# EAGLE design Prototype2 (EAGLE 6.1)
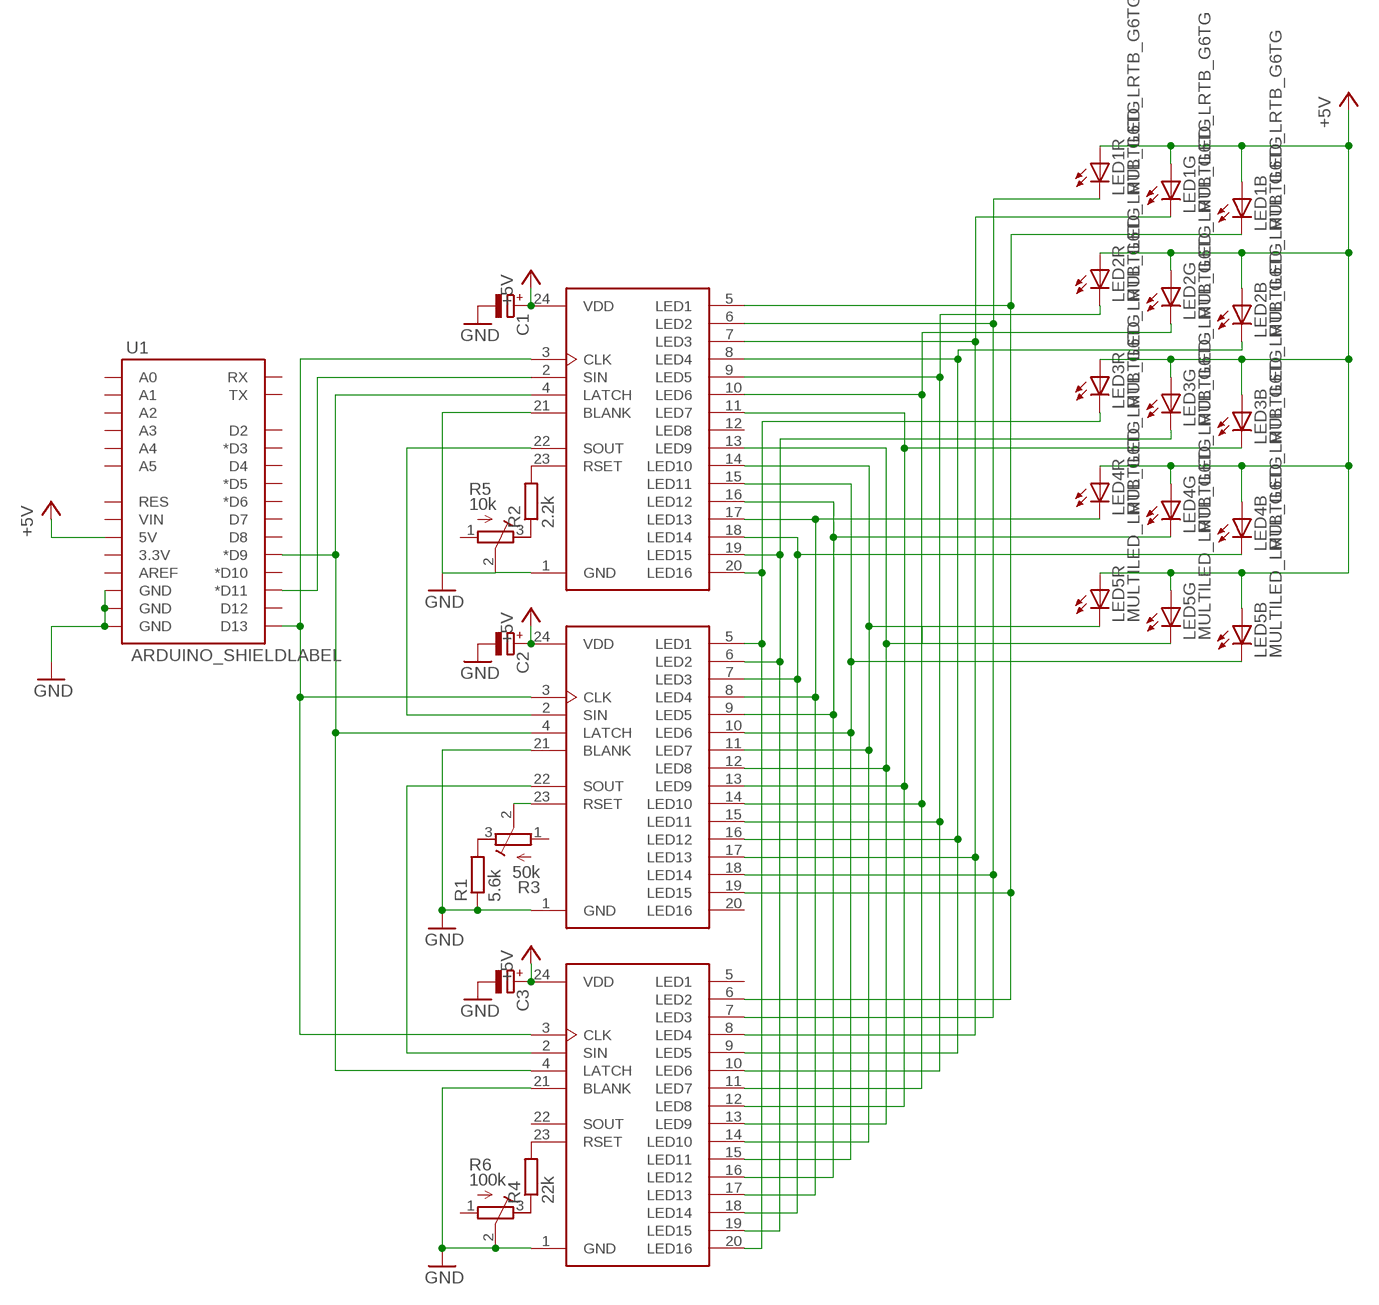
[diagram p0: schematic, sheet 1]

## Parts
C1  CPOL-EUA/3216-18W  [A/3216-18W]
C2  CPOL-EUA/3216-18W  [A/3216-18W]
C3  CPOL-EUA/3216-18W  [A/3216-18W]
LED1  MULTILED_LRTB_G6TG  [P-LCC-6_TOPLED]
LED2  MULTILED_LRTB_G6TG  [P-LCC-6_TOPLED]
LED3  MULTILED_LRTB_G6TG  [P-LCC-6_TOPLED]
LED4  MULTILED_LRTB_G6TG  [P-LCC-6_TOPLED]
LED5  MULTILED_LRTB_G6TG  [P-LCC-6_TOPLED]
R1  5.6k  R-EU_0204/7  [0204/7]
R2  2.2k  R-EU_0204/7  [0204/7]
R3  50k  R-TRIMM3165W  [RTRIM3165W]
R4  22k  R-EU_0204/7  [0204/7]
R5  10k  R-TRIMM3165W  [RTRIM3165W]
R6  100k  R-TRIMM3165W  [RTRIM3165W]
U1  ARDUINO_SHIELDLABEL  [DUEMILANOVE_SHIELD]
U$1  CAT4016  [SOIC24W]
U$2  CAT4016  [SOIC24W]
U$3  CAT4016  [SOIC24W]

## Nets
+5V: C1.+ C2.+ C3.+ LED1.A1(R:A) LED1.A2(G:A) LED1.A3(B:A) LED2.A1(R:A) LED2.A2(G:A) LED2.A3(B:A) LED3.A1(R:A) LED3.A2(G:A) LED3.A3(B:A) LED4.A1(R:A) LED4.A2(G:A) LED4.A3(B:A) LED5.A1(R:A) LED5.A2(G:A) LED5.A3(B:A) U1.5V U$1.24(VDD) U$2.24(VDD) U$3.24(VDD)
GND: C1.- C2.- C3.- R1.1 R5.2(S) R6.2(S) U1.GND@0(GND) U1.GND@1(GND) U1.GND@2(GND) U$1.1(GND) U$1.21(BLANK) U$2.1(GND) U$2.21(BLANK) U$3.1(GND) U$3.21(BLANK)
N$1: R2.2 U$3.23(RSET)
N$2: R2.1 R5.3(E)
N$3: R4.2 U$2.23(RSET)
N$4: U$1.2(SIN) U$3.22(SOUT)
N$5: U1.D11(*D11) U$3.2(SIN)
N$6: U1.D9(*D9) U$1.4(LATCH) U$2.4(LATCH) U$3.4(LATCH)
N$7: R4.1 R6.3(E)
N$8: R1.2 R3.3(E)
N$9: R3.2(S) U$1.23(RSET)
N$10: U$1.22(SOUT) U$2.2(SIN)
N$14: U1.D13 U$1.3(CLK) U$2.3(CLK) U$3.3(CLK)
N$15: LED5.C2(G:C) U$1.12(LED8) U$2.13(LED9) U$3.13(LED9)
N$18: LED5.C1(R:C) U$1.11(LED7) U$2.14(LED10) U$3.14(LED10)
N$19: LED5.C3(B:C) U$1.10(LED6) U$2.15(LED11) U$3.15(LED11)
N$20: LED4.C2(G:C) U$1.9(LED5) U$2.16(LED12) U$3.16(LED12)
N$21: LED4.C1(R:C) U$1.8(LED4) U$2.17(LED13) U$3.17(LED13)
N$22: LED4.C3(B:C) U$1.7(LED3) U$2.18(LED14) U$3.18(LED14)
N$23: LED3.C2(G:C) U$1.6(LED2) U$2.19(LED15) U$3.19(LED15)
N$25: LED3.C3(B:C) U$1.13(LED9) U$2.12(LED8) U$3.11(LED7)
N$31: LED2.C2(G:C) U$1.14(LED10) U$2.11(LED7) U$3.10(LED6)
N$32: LED2.C1(R:C) U$1.15(LED11) U$2.10(LED6) U$3.9(LED5)
N$33: LED2.C3(B:C) U$1.16(LED12) U$2.9(LED5) U$3.8(LED4)
N$34: LED1.C2(G:C) U$1.17(LED13) U$2.8(LED4) U$3.7(LED3)
N$39: LED1.C1(R:C) U$1.18(LED14) U$2.7(LED3) U$3.6(LED2)
N$43: LED1.C3(B:C) U$1.19(LED15) U$2.6(LED2) U$3.5(LED1)
N$59: LED3.C1(R:C) U$1.5(LED1) U$2.20(LED16) U$3.20(LED16)
Unconnected: R3.1(A) R5.1(A) R6.1(A) U1.3.3V U1.A0 U1.A1 U1.A2 U1.A3 U1.A4 U1.A5 U1.AREF U1.D2 U1.D3(*D3) U1.D4 U1.D5(*D5) U1.D6(*D6) U1.D7 U1.D8 U1.D10(*D10) U1.D12 U1.RES U1.RX U1.TX U1.VIN U$1.20(LED16) U$2.5(LED1) U$2.22(SOUT) U$3.12(LED8)

## Library data of the parts
C1-C3 = rcl:CPOL-EU: POLARIZED CAPACITOR, European symbol
LED1-LED5 = customized:MULTILED_LRTB_G6TG: 6-lead MULTILED® Enhanced optical Power LED (ThinFilm® / ThinGaN®) Source. OSRAM - LRTB_G6TG.pdf
R1 R2 R4 = rcl:R-EU_: RESISTOR, European symbol
R3 R5 R6 = rcl:R-TRIMM: Trimm resistor
U1 = SparkFun:ARDUINO_SHIELD
U$1-U$3 = CAT4016:CAT4016: 16-Channel Constant Current LED Driver

## Board
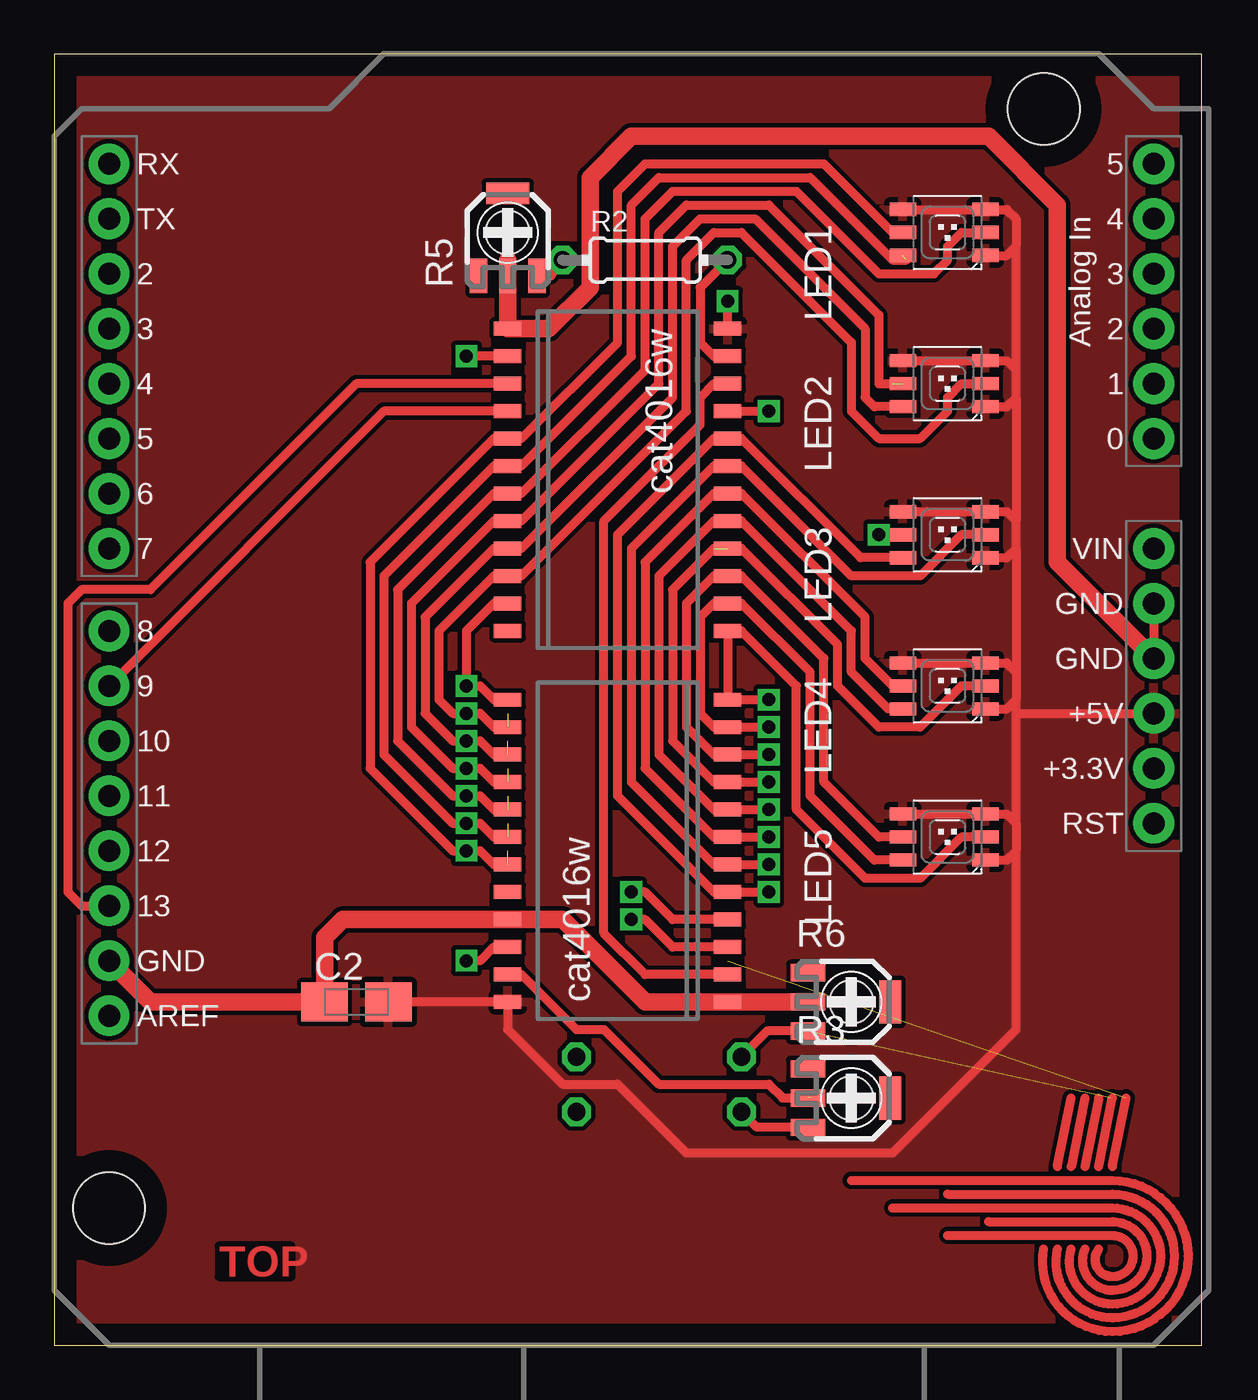
[diagram p1: board, top side]
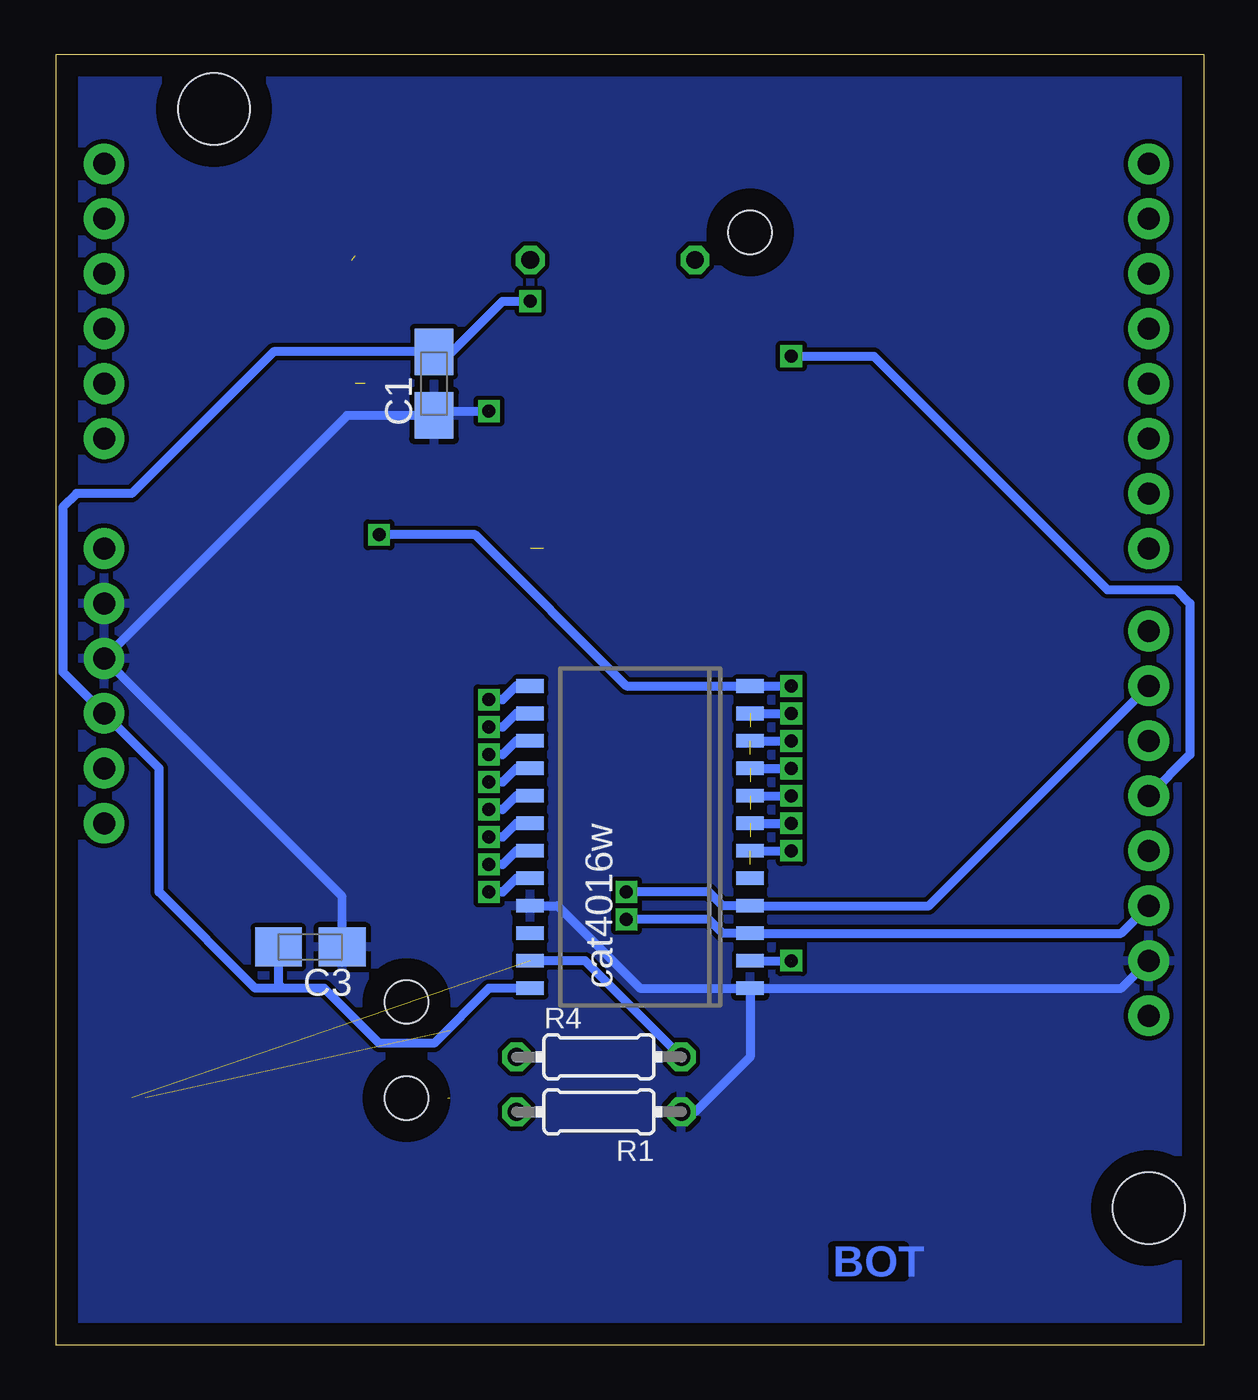
[diagram p2: board, bottom side, seen from below]

Size 53.01 x 59.68 mm. Coordinates in mm from the lower left corner, seen from the top.
Outline: 0,0 53.01,0 53.01,59.68 0,59.68 0,0
Copper layers (1*16): Top 0.035mm / dielectric 1.5mm / Bottom 0.035mm
Design rules: minimum track width 10mil, minimum drill 24mil, track to track 8mil, track to pad 8mil, pad to pad 8mil, via to via 8mil, smd to smd 8mil, copper to edge 40mil, drill to drill 8mil, minimum pad ring 10mil, minimum via ring 8mil, stop-mask expansion 4mil, vias tented up to drill 0mil, thermal gap 10mil

### Footprints (pad centres in the part's own frame; a part is rotated, then mirrored left to right if it is on the bottom)
A/3216-18W = smd 2.15 x 1.8: + 1.475,0; - -1.475,0
P-LCC-6_TOPLED = smd 0.61 x 1.219: A1 -1.062,-1.748; A2 1.062,-1.748; A3 1.062,2.065; C1 -1.062,2.065; C2 0,-1.748; C3 0,2.065
0204/7 = drill 0.813 octagon: 1 -3.81,0; 2 3.81,0
RTRIM3165W = smd 0.8 x 1.6: 1 -1.35,-2; 2 0,-2; 3 1.35,-2 | smd 2 x 1: 4 0,1.8 | hole 2: 0,0
DUEMILANOVE_SHIELD = drill 1.016 pad 1.88: 3.3V 50.8,26.67; 5V 50.8,29.21; A0 50.8,41.91; A1 50.8,44.45; A2 50.8,46.99; A3 50.8,49.53; A4 50.8,52.07; A5 50.8,54.61; AREF 2.54,15.24; D2 2.54,49.53; D3 2.54,46.99; D4 2.54,44.45; D5 2.54,41.91; D6 2.54,39.37; D7 2.54,36.83; D8 2.54,33.02; D9 2.54,30.48; D10 2.54,27.94; D11 2.54,25.4; D12 2.54,22.86; D13 2.54,20.32; GND@0 50.8,31.75; GND@1 50.8,34.29; GND@2 2.54,17.78; RES 50.8,24.13; RX 2.54,54.61; TX 2.54,52.07; VIN 50.8,36.83 | hole 3.302: 45.72,57.15; 2.54,6.35
SOIC24W = smd 0.635 x 1.27: 1 -6.985,-5.08; 2 -5.715,-5.08; 3 -4.445,-5.08; 4 -3.175,-5.08; 5 -1.905,-5.08; 6 -0.635,-5.08; 7 0.635,-5.08; 8 1.905,-5.08; 9 3.175,-5.08; 10 4.445,-5.08; 11 5.715,-5.08; 12 6.985,-5.08; 13 6.985,5.08; 14 5.715,5.08; 15 4.445,5.08; 16 3.175,5.08; 17 1.905,5.08; 18 0.635,5.08; 19 -0.635,5.08; 20 -1.905,5.08; 21 -3.175,5.08; 22 -4.445,5.08; 23 -5.715,5.08; 24 -6.985,5.08

### Placement (x,y rotation side)
C1  35.56,44.45 90 bottom
C2  13.97,15.88 0 top
C3  41.27,18.41 180 bottom
LED1  41.27,51.44 90 top
LED2  41.27,44.45 90 top
LED3  41.27,37.47 90 top
LED4  41.27,30.48 90 top
LED5  41.27,23.5 90 top
R1  27.94,10.79 180 bottom
R2  27.3,50.16 0 top
R3  36.83,11.43 270 top
R4  27.94,13.34 0 bottom
R5  20.95,51.44 0 top
R6  36.83,15.88 270 top
U1  0,0 0 top
U$1  26.04,22.86 90 top
U$2  26.04,23.5 90 bottom
U$3  26.04,40.01 270 top

### Tracks (layer width: path | path; a pad name or v marks a point on that pad's centre or on a via)
+5V
  Top 0.406: LED3.A3 LED3.A2 44.02,38.53 44.45,38.1 | LED3.A1 44.02,36.4 44.45,36.83 | 44.45,36.83 44.45,38.1 | LED4.A3 LED4.A2 44.02,31.54 44.45,31.11 | 44.45,31.11 44.45,29.84 | LED4.A1 44.02,29.42 44.45,29.84 | LED5.A3 LED5.A2 44.02,24.56 44.45,24.13 | LED5.A1 44.02,22.43 44.45,22.86 | 44.45,24.13 44.45,22.86 | C2.+ U$1.24 20.95,14.61 23.5,12.06 26.04,12.06 29.21,8.89 38.73,8.89 44.45,14.61 44.45,22.86 | LED2.A3 LED2.A2 44.02,45.51 44.45,45.09 | 44.45,43.81 44.45,45.09 | LED1.A3 LED1.A2 44.02,52.5 44.45,52.07 44.45,50.8 | LED1.A1 44.02,50.37 44.45,50.8 | 44.45,45.09 44.45,50.8 | LED2.A1 44.02,43.39 44.45,43.81 | 44.45,43.81 44.45,38.1 | 44.45,36.83 44.45,31.11 | 44.45,29.21 44.45,29.84 | 44.45,24.13 44.45,29.21 | 44.45,29.21 U1.5V | U$3.24 31.11,48.26
  Bottom 0.406: 42.55,16.51 43.81,16.51 48.26,20.95 48.26,26.67 U1.5V 52.7,31.11 52.7,38.73 52.07,39.37 49.53,39.37 42.98,45.92 C1.+ 34.72,45.92 32.38,48.26 31.11,48.26 | C3.+ 42.75,16.71 42.55,16.51 | U$2.24 33.02,16.51 35.56,13.97 38.1,13.97 40.64,16.51 42.55,16.51
  pour Top: 0,0 53.34,0 53.34,59.69 0,59.69
GND  (1 unrouted)
  Top 0.406: R5.2 20.95,50.16 | U1.GND@1 U1.GND@0 | U$3.21 33.02,43.18
  Top 0.813: R5.2 U$3.1 | R6.2 U$1.1 27.3,15.88 23.5,19.68 U$1.21 13.34,19.68 12.49,18.84 C2.- 4.45,15.88 U1.GND@2 | U1.GND@0 46.35,36.2 46.35,52.7 43.18,55.88 26.67,55.88 24.77,53.98 24.77,48.9 22.86,46.99 U$3.1 | U$3.1 20.95,50.16
  Bottom 0.406: U$2.1 20.95,13.34 23.5,10.79 R1.1 | U$2.21 29.84,20.32 26.04,16.51 U$2.1 | U1.GND@2 3.81,16.51 U$2.1 | C3.- 39.8,20.75 U1.GND@0 39.58,42.98 C1.- 35.13,42.98 34.92,43.18 33.02,43.18
  pour Bottom: 0,59.69 53.34,59.69 53.34,0 0,0
N$1
  Top 0.406: R2.2 29.84,48.9 29.84,46.35 30.48,45.72 U$3.23
N$2
  Top 0.406: R5.3 22.95,49.44 R2.1
N$3  (1 unrouted)
  Top 0.406: 48.9,8.26 49.53,11.43
  Bottom 0.406: R4.2 28.57,17.78 U$2.23
N$4
  Top 0.406: U$1.2 27.3,17.14 25.4,19.05 25.4,38.1 29.84,42.55 29.84,43.81 30.48,44.45 U$3.22
N$5  (via drill 0.6)
  Top 0.406: U$3.2 v19.05,45.72
  Bottom 0.406: v19.05,45.72 15.24,45.72 4.45,34.92 1.27,34.92 0.64,34.29 0.64,27.3 U1.D11
N$6  (via drill 0.6)
  Top 0.406: U$3.4 15.24,43.18 U1.D9 | U$1.4 28.57,19.68 27.3,20.95 v26.67,20.95
  Bottom 0.406: U1.D9 12.7,20.32 U$2.4 22.23,20.32 22.86,20.95 v26.67,20.95
N$7  (1 unrouted)
  Top 0.406: 48.26,8.26 48.9,11.43 | R6.3 32.94,14.53 R4.1
N$8
  Top 0.406: R3.3 32.47,10.08 R1.2
N$9  (1 unrouted)
  Top 0.406: U$1.23 21.59,17.14 24.13,14.61 25.4,14.61 27.94,12.06 33.02,12.06 33.66,11.43 34.92,11.43
N$10  (1 unrouted)
  Top 0.406: U$1.22 20.32,18.41 19.68,17.78 19.05,17.78
  Bottom 0.406: U$2.2 19.05,17.78
N$11
  Top 0.406: 48.26,11.43 47.62,8.26
N$12
  Top 0.406: 47.62,11.43 46.99,8.26
N$13
  Top 0.406: 46.35,8.26 46.99,11.43
N$14  (via drill 0.6)
  Top 0.406: U$3.3 13.97,44.45 4.45,34.92 1.27,34.92 0.64,34.29 0.64,20.95 1.27,20.32 U1.D13 | U$1.3 28.57,18.41 27.3,19.68 v26.67,19.68
  Bottom 0.406: U1.D13 3.81,19.05 U$2.3 22.23,19.05 22.86,19.68 v26.67,19.68
N$15  (1 unrouted)
  Top 0.406: 33.02,29.84 U$1.12 U$3.13 31.75,33.02 34.29,30.48 34.29,24.77 37.47,21.59 40.01,21.59 41.91,23.5 LED5.C2
  Bottom 0.406: U$2.13 31.75,30.48 32.38,29.84 33.02,29.84
N$18  (1 unrouted)
  Top 0.406: 33.02,28.57 U$1.11 30.48,28.57 29.84,29.21 29.84,33.66 30.48,34.29 U$3.14 31.75,34.29 34.92,31.11 34.92,25.4 37.89,22.43 LED5.C1
  Bottom 0.406: U$2.14 31.75,29.21 32.38,28.57 33.02,28.57
N$19  (1 unrouted)
  Top 0.406: 33.02,27.3 U$1.10 30.48,27.3 29.21,28.57 29.21,34.29 30.48,35.56 U$3.15 31.75,35.56 35.56,31.75 35.56,26.04 38.1,23.5 LED5.C3
  Bottom 0.406: U$2.15 31.75,27.94 32.38,27.3 33.02,27.3
N$20  (2 unrouted)
  Top 0.406: 30.48,36.83 28.57,34.92 28.57,27.94 30.48,26.04 U$1.9 33.02,26.04 | LED4.C2 41.91,30.48 40.01,28.57 38.1,28.57 36.2,30.48 36.2,32.38 31.75,36.83 U$3.16
  Bottom 0.406: U$2.16 31.75,26.67 32.38,26.04 33.02,26.04
N$21  (1 unrouted)
  Top 0.406: 33.02,24.77 U$1.8 30.48,24.77 27.94,27.3 27.94,35.56 30.48,38.1 U$3.17 31.75,38.1 36.83,33.02 36.83,31.11 38.53,29.42 LED4.C1
  Bottom 0.406: U$2.17 31.75,25.4 32.38,24.77 33.02,24.77
N$22  (1 unrouted)
  Top 0.406: 33.02,23.5 U$1.7 30.48,23.5 27.3,26.67 27.3,36.2 30.48,39.37 U$3.18 31.75,39.37 37.47,33.66 37.47,31.75 38.73,30.48 LED4.C3
  Bottom 0.406: U$2.18 31.75,24.13 32.38,23.5 33.02,23.5
N$23  (1 unrouted)
  Top 0.406: 33.02,22.23 U$1.6 30.48,22.23 26.67,26.04 26.67,36.83 30.48,40.64 U$3.19 31.75,40.64 36.83,35.56 40.01,35.56 41.91,37.47 LED3.C2
  Bottom 0.406: U$2.19 31.75,22.86 32.38,22.23 33.02,22.23
N$24  (via drill 0.6)
  other vias: 19.05,17.78
N$25  (2 unrouted)
  Top 0.406: U$3.11 20.32,34.29 19.05,33.02 19.05,30.48 19.68,30.48 20.32,29.84 U$1.13 | LED3.C3 38.1,37.47
  Bottom 0.406: 38.1,37.47 33.66,37.47 26.67,30.48 U$2.12 19.05,30.48
N$31  (1 unrouted)
  Top 0.406: LED2.C2 41.91,44.45 41.27,43.81 41.27,43.18 40.01,41.91 38.1,41.91 36.83,43.18 36.83,46.35 31.75,51.44 30.48,51.44 29.21,50.16 29.21,43.18 21.59,35.56 U$3.10 20.32,35.56 17.78,33.02 17.78,29.84 18.41,29.21 19.68,29.21 20.32,28.57 U$1.14
  Bottom 0.406: U$2.11 19.05,29.21
N$32  (1 unrouted)
  Top 0.406: LED2.C1 37.89,43.39 37.47,43.81 37.47,46.99 32.38,52.07 29.84,52.07 28.57,50.8 28.57,43.81 21.59,36.83 U$3.9 20.32,36.83 17.14,33.66 17.14,29.21 18.41,27.94 19.68,27.94 20.32,27.3 U$1.15
  Bottom 0.406: U$2.10 19.05,27.94
N$33  (2 unrouted)
  Top 0.406: U$1.16 20.32,26.04 19.68,26.67 18.41,26.67 16.51,28.57 16.51,34.29 20.32,38.1 U$3.8 21.59,38.1 27.94,44.45 27.94,51.44 29.21,52.7 33.02,52.7 38.1,47.62 38.1,44.45 38.73,44.45
  Bottom 0.406: U$2.9 19.05,26.67
N$34  (1 unrouted)
  Top 0.406: U$1.17 20.32,24.77 19.68,25.4 18.41,25.4 15.88,27.94 15.88,34.92 20.32,39.37 U$3.7 21.59,39.37 27.3,45.09 27.3,52.07 28.57,53.34 34.29,53.34 38.1,49.53 40.64,49.53 41.27,50.16 41.27,50.8 41.91,51.44 LED1.C2
  Bottom 0.406: U$2.8 19.05,25.4
N$35
  Top 0.406: 41.27,5.08 48.9,5.08 arc-180 48.9,3.17 arc-127 48.26,4.45
N$38
  Top 0.406: 43.18,5.71 48.9,5.71 arc-180 48.9,2.54 arc-113 47.62,4.45
N$39  (2 unrouted)
  Top 0.406: U$1.18 20.32,23.5 19.68,24.13 18.41,24.13 15.24,27.3 15.24,35.56 20.32,40.64 U$3.6 21.59,40.64 26.67,45.72 26.67,52.7 27.94,53.98 34.92,53.98 38.73,50.16 39.37,50.16
  Bottom 0.406: U$2.7 19.05,24.13
N$40
  Top 0.406: 38.73,6.35 48.9,6.35 arc-180 48.9,1.91 arc-106 46.99,4.45
N$41
  Top 0.406: 41.27,6.99 48.9,6.99 arc-180 48.9,1.27 arc-103 46.35,4.45
N$42
  Top 0.406: 36.83,7.62 48.9,7.62 arc-180 48.9,0.64 arc-100 45.72,4.45
N$43  (1 unrouted)
  Top 0.406: LED1.C3 38.73,51.44 35.56,54.61 27.3,54.61 26.04,53.34 26.04,46.35 21.59,41.91 U$3.5 20.32,41.91 14.61,36.2 14.61,26.67 18.41,22.86 19.68,22.86 20.32,22.23 U$1.19
  Bottom 0.406: U$2.6 19.05,22.86
N$44  (via drill 0.6)
  other vias: 19.05,30.48
N$45  (via drill 0.6)
  other vias: 19.05,29.21
N$46  (via drill 0.6)
  other vias: 19.05,27.94
N$47  (via drill 0.6)
  other vias: 19.05,26.67
N$48  (via drill 0.6)
  other vias: 19.05,25.4
N$49  (via drill 0.6)
  other vias: 19.05,24.13
N$50  (via drill 0.6)
  other vias: 19.05,22.86
N$51  (via drill 0.6)
  other vias: 33.02,29.84
N$52  (via drill 0.6)
  other vias: 33.02,28.57
N$53  (via drill 0.6)
  other vias: 33.02,27.3
N$54  (via drill 0.6)
  other vias: 33.02,26.04
N$55  (via drill 0.6)
  other vias: 33.02,24.77
N$56  (via drill 0.6)
  other vias: 33.02,23.5
N$57  (via drill 0.6)
  other vias: 33.02,22.23
N$58  (via drill 0.6)
  other vias: 33.02,20.95
N$59  (1 unrouted)
  Top 0.406: 33.02,20.95 U$1.5 30.48,20.95 26.04,25.4 26.04,37.47 30.48,41.91 U$3.20 31.75,41.91 37.26,36.4 LED3.C1
  Bottom 0.406: U$2.20 31.75,21.59 32.38,20.95 33.02,20.95
N$61  (via drill 0.6)
  other vias: 33.02,43.18
N$62  (via drill 0.6)
  other vias: 38.1,37.47
N$99  (via drill 0.6)
  other vias: 31.11,48.26

### Text on the board
Top: TOP
Bottom: BOT